# EAGLE design Keybon12 REV 1.0 (EAGLE 9.6.2)
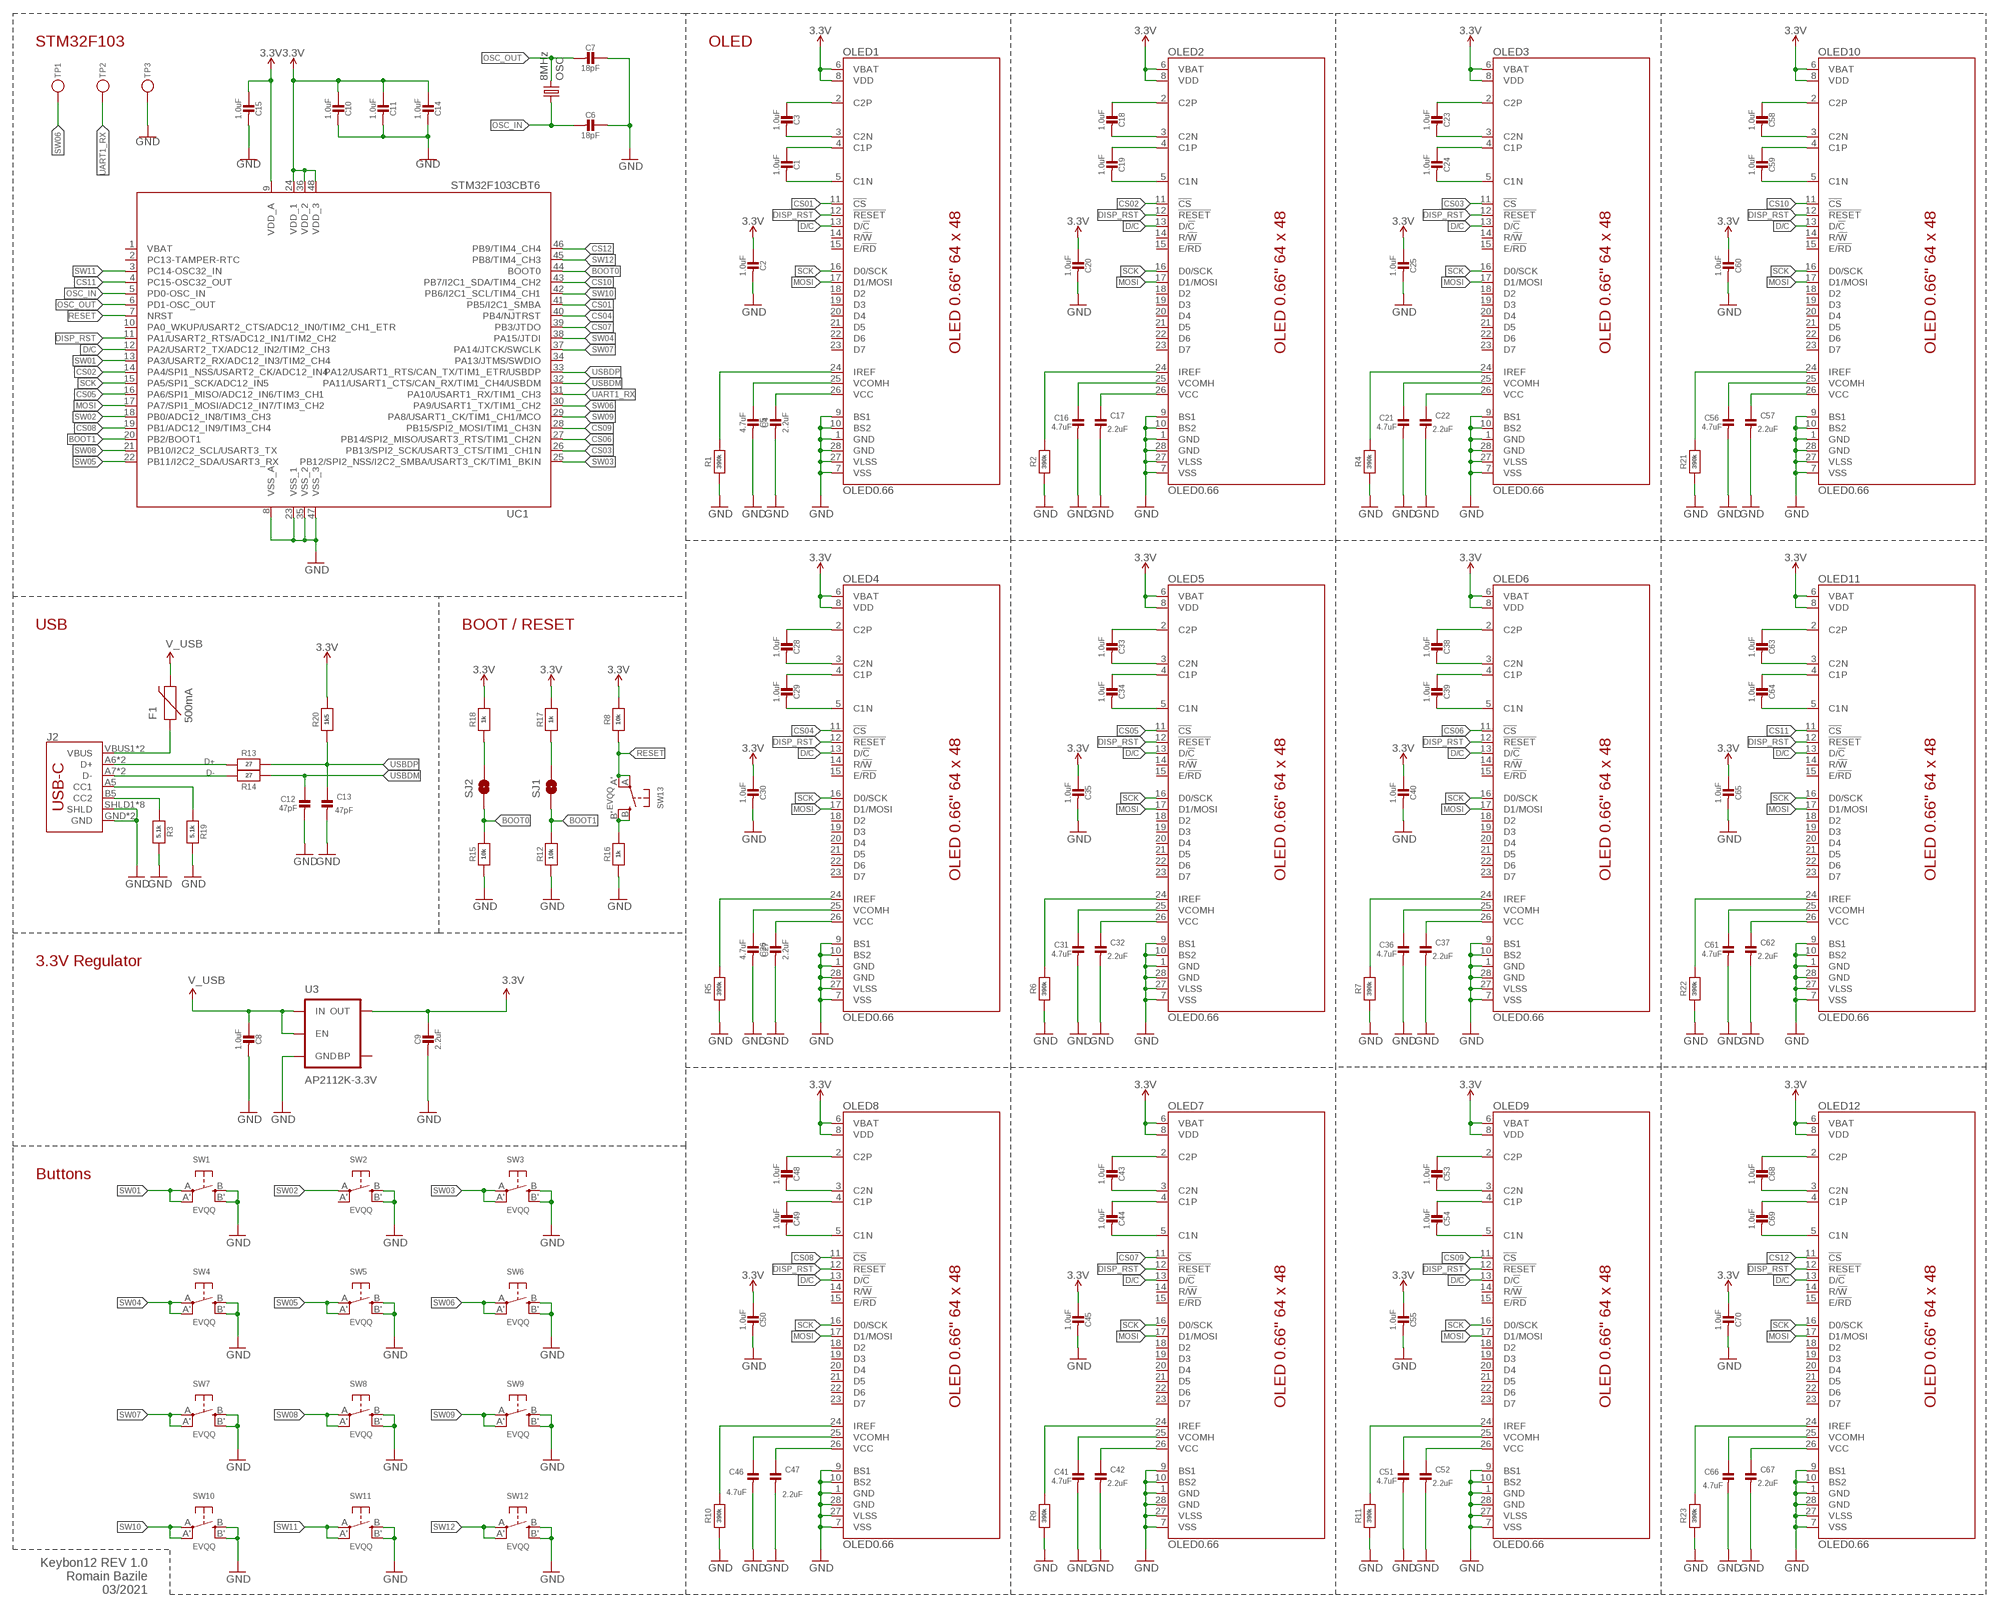
[diagram p0: schematic, sheet 1]

## Parts
C1  1.0uF  CAP_CERAMIC_0805MP  [_0805MP]
C2  1.0uF  CAP_CERAMIC_0805MP  [_0805MP]
C3  1.0uF  CAP_CERAMIC_0805MP  [_0805MP]
C4  2.2uF  CAP_CERAMIC_0805MP  [_0805MP]
C5  4.7uF  CAP_CERAMIC_0805MP  [_0805MP]
C6  18pF  CAP_CERAMIC_0805MP  [_0805MP]
C7  18pF  CAP_CERAMIC_0805MP  [_0805MP]
C8  1.0uF  CAP_CERAMIC_0805MP  [_0805MP]
C9  2.2uF  CAP_CERAMIC_0805MP  [_0805MP]
C10  1.0uF  CAP_CERAMIC_0805MP  [_0805MP]
C11  1.0uF  CAP_CERAMIC_0805MP  [_0805MP]
C12  47pF  CAP_CERAMIC_0805MP  [_0805MP]
C13  47pF  CAP_CERAMIC_0805MP  [_0805MP]
C14  1.0uF  CAP_CERAMIC_0805MP  [_0805MP]
C15  1.0uF  CAP_CERAMIC_0805MP  [_0805MP]
C16  4.7uF  CAP_CERAMIC_0805MP  [_0805MP]
C17  2.2uF  CAP_CERAMIC_0805MP  [_0805MP]
C18  1.0uF  CAP_CERAMIC_0805MP  [_0805MP]
C19  1.0uF  CAP_CERAMIC_0805MP  [_0805MP]
C20  1.0uF  CAP_CERAMIC_0805MP  [_0805MP]
C21  4.7uF  CAP_CERAMIC_0805MP  [_0805MP]
C22  2.2uF  CAP_CERAMIC_0805MP  [_0805MP]
C23  1.0uF  CAP_CERAMIC_0805MP  [_0805MP]
C24  1.0uF  CAP_CERAMIC_0805MP  [_0805MP]
C25  1.0uF  CAP_CERAMIC_0805MP  [_0805MP]
C26  4.7uF  CAP_CERAMIC_0805MP  [_0805MP]
C27  2.2uF  CAP_CERAMIC_0805MP  [_0805MP]
C28  1.0uF  CAP_CERAMIC_0805MP  [_0805MP]
C29  1.0uF  CAP_CERAMIC_0805MP  [_0805MP]
C30  1.0uF  CAP_CERAMIC_0805MP  [_0805MP]
C31  4.7uF  CAP_CERAMIC_0805MP  [_0805MP]
C32  2.2uF  CAP_CERAMIC_0805MP  [_0805MP]
C33  1.0uF  CAP_CERAMIC_0805MP  [_0805MP]
C34  1.0uF  CAP_CERAMIC_0805MP  [_0805MP]
C35  1.0uF  CAP_CERAMIC_0805MP  [_0805MP]
C36  4.7uF  CAP_CERAMIC_0805MP  [_0805MP]
C37  2.2uF  CAP_CERAMIC_0805MP  [_0805MP]
C38  1.0uF  CAP_CERAMIC_0805MP  [_0805MP]
C39  1.0uF  CAP_CERAMIC_0805MP  [_0805MP]
C40  1.0uF  CAP_CERAMIC_0805MP  [_0805MP]
C41  4.7uF  CAP_CERAMIC_0805MP  [_0805MP]
C42  2.2uF  CAP_CERAMIC_0805MP  [_0805MP]
C43  1.0uF  CAP_CERAMIC_0805MP  [_0805MP]
C44  1.0uF  CAP_CERAMIC_0805MP  [_0805MP]
C45  1.0uF  CAP_CERAMIC_0805MP  [_0805MP]
C46  4.7uF  CAP_CERAMIC_0805MP  [_0805MP]
C47  2.2uF  CAP_CERAMIC_0805MP  [_0805MP]
C48  1.0uF  CAP_CERAMIC_0805MP  [_0805MP]
C49  1.0uF  CAP_CERAMIC_0805MP  [_0805MP]
C50  1.0uF  CAP_CERAMIC_0805MP  [_0805MP]
C51  4.7uF  CAP_CERAMIC_0805MP  [_0805MP]
C52  2.2uF  CAP_CERAMIC_0805MP  [_0805MP]
C53  1.0uF  CAP_CERAMIC_0805MP  [_0805MP]
C54  1.0uF  CAP_CERAMIC_0805MP  [_0805MP]
C55  1.0uF  CAP_CERAMIC_0805MP  [_0805MP]
C56  4.7uF  CAP_CERAMIC_0805MP  [_0805MP]
C57  2.2uF  CAP_CERAMIC_0805MP  [_0805MP]
C58  1.0uF  CAP_CERAMIC_0805MP  [_0805MP]
C59  1.0uF  CAP_CERAMIC_0805MP  [_0805MP]
C60  1.0uF  CAP_CERAMIC_0805MP  [_0805MP]
C61  4.7uF  CAP_CERAMIC_0805MP  [_0805MP]
C62  2.2uF  CAP_CERAMIC_0805MP  [_0805MP]
C63  1.0uF  CAP_CERAMIC_0805MP  [_0805MP]
C64  1.0uF  CAP_CERAMIC_0805MP  [_0805MP]
C65  1.0uF  CAP_CERAMIC_0805MP  [_0805MP]
C66  4.7uF  CAP_CERAMIC_0805MP  [_0805MP]
C67  2.2uF  CAP_CERAMIC_0805MP  [_0805MP]
C68  1.0uF  CAP_CERAMIC_0805MP  [_0805MP]
C69  1.0uF  CAP_CERAMIC_0805MP  [_0805MP]
C70  1.0uF  CAP_CERAMIC_0805MP  [_0805MP]
F1  500mA  PTCSMD  [PTC-1206]
J2  USB_C16PIN  [USB-C-16P]
OLED1  OLED0.66  [OLED-0.66-64X48]
OLED2  OLED0.66  [OLED-0.66-64X48]
OLED3  OLED0.66  [OLED-0.66-64X48]
OLED4  OLED0.66  [OLED-0.66-64X48]
OLED5  OLED0.66  [OLED-0.66-64X48]
OLED6  OLED0.66  [OLED-0.66-64X48]
OLED7  OLED0.66  [OLED-0.66-64X48]
OLED8  OLED0.66  [OLED-0.66-64X48]
OLED9  OLED0.66  [OLED-0.66-64X48]
OLED10  OLED0.66  [OLED-0.66-64X48]
OLED11  OLED0.66  [OLED-0.66-64X48]
OLED12  OLED0.66  [OLED-0.66-64X48]
OSC  8MHz  CRYSTAL5X3  [CRYSTAL-SMD-5X3]
R1  390k  RESISTOR_0805MP  [_0805MP]
R2  390k  RESISTOR_0805MP  [_0805MP]
R3  5.1k  RESISTOR_0805MP  [_0805MP]
R4  390k  RESISTOR_0805MP  [_0805MP]
R5  390k  RESISTOR_0805MP  [_0805MP]
R6  390k  RESISTOR_0805MP  [_0805MP]
R7  390k  RESISTOR_0805MP  [_0805MP]
R8  10k  RESISTOR_0805MP  [_0805MP]
R9  390k  RESISTOR_0805MP  [_0805MP]
R10  390k  RESISTOR_0805MP  [_0805MP]
R11  390k  RESISTOR_0805MP  [_0805MP]
R12  10k  RESISTOR_0805MP  [_0805MP]
R13  27  RESISTOR_0805MP  [_0805MP]
R14  27  RESISTOR_0805MP  [_0805MP]
R15  10k  RESISTOR_0805MP  [_0805MP]
R16  1k  RESISTOR_0805MP  [_0805MP]
R17  1k  RESISTOR_0805MP  [_0805MP]
R18  1k  RESISTOR_0805MP  [_0805MP]
R19  5.1k  RESISTOR_0805MP  [_0805MP]
R20  1k5  RESISTOR_0805MP  [_0805MP]
R21  390k  RESISTOR_0805MP  [_0805MP]
R22  390k  RESISTOR_0805MP  [_0805MP]
R23  390k  RESISTOR_0805MP  [_0805MP]
SJ1  JUMPER-PAD-2-NOYES_SILK  [PAD-JUMPER-2-NO_YES_SILK]
SJ2  JUMPER-PAD-2-NOYES_SILK  [PAD-JUMPER-2-NO_YES_SILK]
SW1  EVQQ  SWITCH_TACT_SMT_EVQQ2_SMALL  [EVQ-Q2_SMALLER]
SW2  EVQQ  SWITCH_TACT_SMT_EVQQ2_SMALL  [EVQ-Q2_SMALLER]
SW3  EVQQ  SWITCH_TACT_SMT_EVQQ2_SMALL  [EVQ-Q2_SMALLER]
SW4  EVQQ  SWITCH_TACT_SMT_EVQQ2_SMALL  [EVQ-Q2_SMALLER]
SW5  EVQQ  SWITCH_TACT_SMT_EVQQ2_SMALL  [EVQ-Q2_SMALLER]
SW6  EVQQ  SWITCH_TACT_SMT_EVQQ2_SMALL  [EVQ-Q2_SMALLER]
SW7  EVQQ  SWITCH_TACT_SMT_EVQQ2_SMALL  [EVQ-Q2_SMALLER]
SW8  EVQQ  SWITCH_TACT_SMT_EVQQ2_SMALL  [EVQ-Q2_SMALLER]
SW9  EVQQ  SWITCH_TACT_SMT_EVQQ2_SMALL  [EVQ-Q2_SMALLER]
SW10  EVQQ  SWITCH_TACT_SMT_EVQQ2_SMALL  [EVQ-Q2_SMALLER]
SW11  EVQQ  SWITCH_TACT_SMT_EVQQ2_SMALL  [EVQ-Q2_SMALLER]
SW12  EVQQ  SWITCH_TACT_SMT_EVQQ2_SMALL  [EVQ-Q2_SMALLER]
SW13  EVQQ  SWITCH_TACT_SMT_EVQQ2_SMALL  [EVQ-Q2_SMALLER]
TP1  TESTPOINTPAD2MM  [TESTPOINT_PAD_2MM]
TP2  TESTPOINTPAD2MM  [TESTPOINT_PAD_2MM]
TP3  TESTPOINTPAD2MM  [TESTPOINT_PAD_2MM]
U3  AP2112K-3.3V  V_REG_LDOSMD  [SOT23-5]
UC1  STM32F103CBT6  STM32F103CB  [LQFP48]

## Nets
3.3V: C2.1 C9.1 C10.1 C11.1 C14.1 C15.1 C20.1 C25.1 C30.1 C35.1 C40.1 C45.1 C50.1 C55.1 C60.1 C65.1 C70.1 OLED1.6(VBAT) OLED1.8(VDD) OLED2.6(VBAT) OLED2.8(VDD) OLED3.6(VBAT) OLED3.8(VDD) OLED4.6(VBAT) OLED4.8(VDD) OLED5.6(VBAT) OLED5.8(VDD) OLED6.6(VBAT) OLED6.8(VDD) OLED7.6(VBAT) OLED7.8(VDD) OLED8.6(VBAT) OLED8.8(VDD) OLED9.6(VBAT) OLED9.8(VDD) OLED10.6(VBAT) OLED10.8(VDD) OLED11.6(VBAT) OLED11.8(VDD) OLED12.6(VBAT) OLED12.8(VDD) R8.2 R17.2 R18.2 R20.2 U3.5(OUT) UC1.9(VDD_A) UC1.24(VDD_1) UC1.36(VDD_2) UC1.48(VDD_3)
BOOT0: R15.2 SJ2.1 UC1.44(BOOT0)
BOOT1: R12.2 SJ1.1 UC1.20(PB2/BOOT1)
C1N: C1.2 OLED1.5(C1N)
C1N1: C19.2 OLED2.5(C1N)
C1N2: C24.2 OLED3.5(C1N)
C1N3: C29.2 OLED4.5(C1N)
C1N4: C34.2 OLED5.5(C1N)
C1N5: C39.2 OLED6.5(C1N)
C1N6: C44.2 OLED7.5(C1N)
C1N7: C49.2 OLED8.5(C1N)
C1N8: C54.2 OLED9.5(C1N)
C1N9: C59.2 OLED10.5(C1N)
C1N10: C64.2 OLED11.5(C1N)
C1N11: C69.2 OLED12.5(C1N)
C1P: C1.1 OLED1.4(C1P)
C1P1: C19.1 OLED2.4(C1P)
C1P2: C24.1 OLED3.4(C1P)
C1P3: C29.1 OLED4.4(C1P)
C1P4: C34.1 OLED5.4(C1P)
C1P5: C39.1 OLED6.4(C1P)
C1P6: C44.1 OLED7.4(C1P)
C1P7: C49.1 OLED8.4(C1P)
C1P8: C54.1 OLED9.4(C1P)
C1P9: C59.1 OLED10.4(C1P)
C1P10: C64.1 OLED11.4(C1P)
C1P11: C69.1 OLED12.4(C1P)
C2N: C3.2 OLED1.3(C2N)
C2N1: C18.2 OLED2.3(C2N)
C2N2: C23.2 OLED3.3(C2N)
C2N3: C28.2 OLED4.3(C2N)
C2N4: C33.2 OLED5.3(C2N)
C2N5: C38.2 OLED6.3(C2N)
C2N6: C43.2 OLED7.3(C2N)
C2N7: C48.2 OLED8.3(C2N)
C2N8: C53.2 OLED9.3(C2N)
C2N9: C58.2 OLED10.3(C2N)
C2N10: C63.2 OLED11.3(C2N)
C2N11: C68.2 OLED12.3(C2N)
C2P: C3.1 OLED1.2(C2P)
C2P1: C18.1 OLED2.2(C2P)
C2P2: C23.1 OLED3.2(C2P)
C2P3: C28.1 OLED4.2(C2P)
C2P4: C33.1 OLED5.2(C2P)
C2P5: C38.1 OLED6.2(C2P)
C2P6: C43.1 OLED7.2(C2P)
C2P7: C48.1 OLED8.2(C2P)
C2P8: C53.1 OLED9.2(C2P)
C2P9: C58.1 OLED10.2(C2P)
C2P10: C63.1 OLED11.2(C2P)
C2P11: C68.1 OLED12.2(C2P)
CS01: OLED1.11(!CS!) UC1.41(PB5/I2C1_SMBA)
CS02: OLED2.11(!CS!) UC1.14(PA4/SPI1_NSS/USART2_CK/ADC12_IN4)
CS03: OLED3.11(!CS!) UC1.26(PB13/SPI2_SCK/USART3_CTS/TIM1_CH1N)
CS04: OLED4.11(!CS!) UC1.40(PB4/NJTRST)
CS05: OLED5.11(!CS!) UC1.16(PA6/SPI1_MISO/ADC12_IN6/TIM3_CH1)
CS06: OLED6.11(!CS!) UC1.27(PB14/SPI2_MISO/USART3_RTS/TIM1_CH2N)
CS07: OLED7.11(!CS!) UC1.39(PB3/JTDO)
CS08: OLED8.11(!CS!) UC1.19(PB1/ADC12_IN9/TIM3_CH4)
CS09: OLED9.11(!CS!) UC1.28(PB15/SPI2_MOSI/TIM1_CH3N)
CS10: OLED10.11(!CS!) UC1.43(PB7/I2C1_SDA/TIM4_CH2)
CS11: OLED11.11(!CS!) UC1.4(PC15-OSC32_OUT)
CS12: OLED12.11(!CS!) UC1.46(PB9/TIM4_CH4)
D+: J2.A6(D+) J2.B6(D+) R13.1
D-: J2.A7(D-) J2.B7(D-) R14.1
D/C: OLED1.13(D/!C!) OLED2.13(D/!C!) OLED3.13(D/!C!) OLED4.13(D/!C!) OLED5.13(D/!C!) OLED6.13(D/!C!) OLED7.13(D/!C!) OLED8.13(D/!C!) OLED9.13(D/!C!) OLED10.13(D/!C!) OLED11.13(D/!C!) OLED12.13(D/!C!) UC1.12(PA2/USART2_TX/ADC12_IN2/TIM2_CH3)
DISP_RST: OLED1.12(!RESET!) OLED2.12(!RESET!) OLED3.12(!RESET!) OLED4.12(!RESET!) OLED5.12(!RESET!) OLED6.12(!RESET!) OLED7.12(!RESET!) OLED8.12(!RESET!) OLED9.12(!RESET!) OLED10.12(!RESET!) OLED11.12(!RESET!) OLED12.12(!RESET!) UC1.11(PA1/USART2_RTS/ADC12_IN1/TIM2_CH2)
GND: C2.2 C4.2 C5.2 C6.1 C7.1 C8.2 C9.2 C10.2 C11.2 C12.2 C13.2 C14.2 C15.2 C16.2 C17.2 C20.2 C21.2 C22.2 C25.2 C26.2 C27.2 C30.2 C31.2 C32.2 C35.2 C36.2 C37.2 C40.2 C41.2 C42.2 C45.2 C46.2 C47.2 C50.2 C51.2 C52.2 C55.2 C56.2 C57.2 C60.2 C61.2 C62.2 C65.2 C66.2 C67.2 C70.2 J2.GND J2.GND2(GND) J2.SHLD1(SHLD) J2.SHLD2(SHLD) J2.SHLD3(SHLD) J2.SHLD4(SHLD) J2.SHLD5(SHLD) J2.SHLD6(SHLD) J2.SHLD7(SHLD) J2.SHLD8(SHLD) OLED1.1(GND) OLED1.7(VSS) OLED1.9(BS1) OLED1.10(BS2) OLED1.27(VLSS) OLED1.28(GND) OLED2.1(GND) OLED2.7(VSS) OLED2.9(BS1) OLED2.10(BS2) OLED2.27(VLSS) OLED2.28(GND) OLED3.1(GND) OLED3.7(VSS) OLED3.9(BS1) OLED3.10(BS2) OLED3.27(VLSS) OLED3.28(GND) OLED4.1(GND) OLED4.7(VSS) OLED4.9(BS1) OLED4.10(BS2) OLED4.27(VLSS) OLED4.28(GND) OLED5.1(GND) OLED5.7(VSS) OLED5.9(BS1) OLED5.10(BS2) OLED5.27(VLSS) OLED5.28(GND) OLED6.1(GND) OLED6.7(VSS) OLED6.9(BS1) OLED6.10(BS2) OLED6.27(VLSS) OLED6.28(GND) OLED7.1(GND) OLED7.7(VSS) OLED7.9(BS1) OLED7.10(BS2) OLED7.27(VLSS) OLED7.28(GND) OLED8.1(GND) OLED8.7(VSS) OLED8.9(BS1) OLED8.10(BS2) OLED8.27(VLSS) OLED8.28(GND) OLED9.1(GND) OLED9.7(VSS) OLED9.9(BS1) OLED9.10(BS2) OLED9.27(VLSS) OLED9.28(GND) OLED10.1(GND) OLED10.7(VSS) OLED10.9(BS1) OLED10.10(BS2) OLED10.27(VLSS) OLED10.28(GND) OLED11.1(GND) OLED11.7(VSS) OLED11.9(BS1) OLED11.10(BS2) OLED11.27(VLSS) OLED11.28(GND) OLED12.1(GND) OLED12.7(VSS) OLED12.9(BS1) OLED12.10(BS2) OLED12.27(VLSS) OLED12.28(GND) R1.2 R2.2 R3.2 R4.2 R5.2 R6.2 R7.2 R9.2 R10.2 R11.2 R12.1 R15.1 R16.1 R19.2 R21.2 R22.2 R23.2 SW1.B'(S1) SW1.B(S) SW2.B'(S1) SW2.B(S) SW3.B'(S1) SW3.B(S) SW4.B'(S1) SW4.B(S) SW5.B'(S1) SW5.B(S) SW6.B'(S1) SW6.B(S) SW7.B'(S1) SW7.B(S) SW8.B'(S1) SW8.B(S) SW9.B'(S1) SW9.B(S) SW10.B'(S1) SW10.B(S) SW11.B'(S1) SW11.B(S) SW12.B'(S1) SW12.B(S) TP3.P$1 U3.2(GND) UC1.8(VSS_A) UC1.23(VSS_1) UC1.35(VSS_2) UC1.47(VSS_3)
IREF: OLED1.24(IREF) R1.1
IREF1: OLED2.24(IREF) R2.1
IREF2: OLED3.24(IREF) R4.1
IREF3: OLED4.24(IREF) R5.1
IREF4: OLED5.24(IREF) R6.1
IREF5: OLED6.24(IREF) R7.1
IREF6: OLED7.24(IREF) R9.1
IREF7: OLED8.24(IREF) R10.1
IREF8: OLED9.24(IREF) R11.1
IREF9: OLED10.24(IREF) R21.1
IREF10: OLED11.24(IREF) R22.1
IREF11: OLED12.24(IREF) R23.1
MOSI: OLED1.17(D1/MOSI) OLED2.17(D1/MOSI) OLED3.17(D1/MOSI) OLED4.17(D1/MOSI) OLED5.17(D1/MOSI) OLED6.17(D1/MOSI) OLED7.17(D1/MOSI) OLED8.17(D1/MOSI) OLED9.17(D1/MOSI) OLED10.17(D1/MOSI) OLED11.17(D1/MOSI) OLED12.17(D1/MOSI) UC1.17(PA7/SPI1_MOSI/ADC12_IN7/TIM3_CH2)
N$1: R16.2 SW13.B'(S1) SW13.B(S)
N$2: R18.1 SJ2.2
N$3: R17.1 SJ1.2
N$4: C4.1 OLED1.26(VCC)
N$5: C17.1 OLED2.26(VCC)
N$6: C22.1 OLED3.26(VCC)
N$7: C37.1 OLED6.26(VCC)
N$8: C32.1 OLED5.26(VCC)
N$9: J2.A5(CC1) R19.1
N$10: C27.1 OLED4.26(VCC)
N$11: J2.B5(CC2) R3.1
N$12: C47.1 OLED8.26(VCC)
N$13: C42.1 OLED7.26(VCC)
N$14: C52.1 OLED9.26(VCC)
N$15: C57.1 OLED10.26(VCC)
N$16: C62.1 OLED11.26(VCC)
N$17: C67.1 OLED12.26(VCC)
OSC_IN: C6.2 OSC.1 UC1.5(PD0-OSC_IN)
OSC_OUT: C7.2 OSC.3 UC1.6(PD1-OSC_OUT)
RESET: R8.1 SW13.A'(P1) SW13.A(P) UC1.7(NRST)
SCK: OLED1.16(D0/SCK) OLED2.16(D0/SCK) OLED3.16(D0/SCK) OLED4.16(D0/SCK) OLED5.16(D0/SCK) OLED6.16(D0/SCK) OLED7.16(D0/SCK) OLED8.16(D0/SCK) OLED9.16(D0/SCK) OLED10.16(D0/SCK) OLED11.16(D0/SCK) OLED12.16(D0/SCK) UC1.15(PA5/SPI1_SCK/ADC12_IN5)
SW01: SW1.A'(P1) SW1.A(P) UC1.13(PA3/USART2_RX/ADC12_IN3/TIM2_CH4)
SW02: SW2.A(P) UC1.18(PB0/ADC12_IN8/TIM3_CH3)
SW03: SW3.A'(P1) SW3.A(P) UC1.25(PB12/SPI2_NSS/I2C2_SMBA/USART3_CK/TIM1_BKIN)
SW04: SW4.A'(P1) SW4.A(P) UC1.38(PA15/JTDI)
SW05: SW5.A'(P1) SW5.A(P) UC1.22(PB11/I2C2_SDA/USART3_RX)
SW06: SW6.A'(P1) SW6.A(P) TP1.P$1 UC1.30(PA9/USART1_TX/TIM1_CH2)
SW07: SW7.A'(P1) SW7.A(P) UC1.37(PA14/JTCK/SWCLK)
SW08: SW8.A'(P1) SW8.A(P) UC1.21(PB10/I2C2_SCL/USART3_TX)
SW09: SW9.A'(P1) SW9.A(P) UC1.29(PA8/USART1_CK/TIM1_CH1/MCO)
SW10: SW10.A'(P1) SW10.A(P) UC1.42(PB6/I2C1_SCL/TIM4_CH1)
SW11: SW11.A'(P1) SW11.A(P) UC1.3(PC14-OSC32_IN)
SW12: SW12.A'(P1) SW12.A(P) UC1.45(PB8/TIM4_CH3)
UART1_RX: TP2.P$1 UC1.31(PA10/USART1_RX/TIM1_CH3)
USBDM: C12.1 R14.2 UC1.32(PA11/USART1_CTS/CAN_RX/TIM1_CH4/USBDM)
USBDP: C13.1 R13.2 R20.1 UC1.33(PA12/USART1_RTS/CAN_TX/TIM1_ETR/USBDP)
V_USB: C8.1 F1.2 U3.1(IN) U3.3(EN)
VCOMH: C5.1 OLED1.25(VCOMH)
VCOMH1: C16.1 OLED2.25(VCOMH)
VCOMH2: C21.1 OLED3.25(VCOMH)
VCOMH3: C26.1 OLED4.25(VCOMH)
VCOMH4: C31.1 OLED5.25(VCOMH)
VCOMH5: C36.1 OLED6.25(VCOMH)
VCOMH6: C41.1 OLED7.25(VCOMH)
VCOMH7: C46.1 OLED8.25(VCOMH)
VCOMH8: C51.1 OLED9.25(VCOMH)
VCOMH9: C56.1 OLED10.25(VCOMH)
VCOMH10: C61.1 OLED11.25(VCOMH)
VCOMH11: C66.1 OLED12.25(VCOMH)
VUSB-RAW: F1.1 J2.VBUS1(VBUS) J2.VBUS2(VBUS)
Unconnected: OLED1.14(R/!W!) OLED1.15(E/!RD!) OLED1.18(D2) OLED1.19(D3) OLED1.20(D4) OLED1.21(D5) OLED1.22(D6) OLED1.23(D7) OLED2.14(R/!W!) OLED2.15(E/!RD!) OLED2.18(D2) OLED2.19(D3) OLED2.20(D4) OLED2.21(D5) OLED2.22(D6) OLED2.23(D7) OLED3.14(R/!W!) OLED3.15(E/!RD!) OLED3.18(D2) OLED3.19(D3) OLED3.20(D4) OLED3.21(D5) OLED3.22(D6) OLED3.23(D7) OLED4.14(R/!W!) OLED4.15(E/!RD!) OLED4.18(D2) OLED4.19(D3) OLED4.20(D4) OLED4.21(D5) OLED4.22(D6) OLED4.23(D7) OLED5.14(R/!W!) OLED5.15(E/!RD!) OLED5.18(D2) OLED5.19(D3) OLED5.20(D4) OLED5.21(D5) OLED5.22(D6) OLED5.23(D7) OLED6.14(R/!W!) OLED6.15(E/!RD!) OLED6.18(D2) OLED6.19(D3) OLED6.20(D4) OLED6.21(D5) OLED6.22(D6) OLED6.23(D7) OLED7.14(R/!W!) OLED7.15(E/!RD!) OLED7.18(D2) OLED7.19(D3) OLED7.20(D4) OLED7.21(D5) OLED7.22(D6) OLED7.23(D7) OLED8.14(R/!W!) OLED8.15(E/!RD!) OLED8.18(D2) OLED8.19(D3) OLED8.20(D4) OLED8.21(D5) OLED8.22(D6) OLED8.23(D7) OLED9.14(R/!W!) OLED9.15(E/!RD!) OLED9.18(D2) OLED9.19(D3) OLED9.20(D4) OLED9.21(D5) OLED9.22(D6) OLED9.23(D7) OLED10.14(R/!W!) OLED10.15(E/!RD!) OLED10.18(D2) OLED10.19(D3) OLED10.20(D4) OLED10.21(D5) OLED10.22(D6) OLED10.23(D7) OLED11.14(R/!W!) OLED11.15(E/!RD!) OLED11.18(D2) OLED11.19(D3) OLED11.20(D4) OLED11.21(D5) OLED11.22(D6) OLED11.23(D7) OLED12.14(R/!W!) OLED12.15(E/!RD!) OLED12.18(D2) OLED12.19(D3) OLED12.20(D4) OLED12.21(D5) OLED12.22(D6) OLED12.23(D7) SW2.A'(P1) U3.4(BP) UC1.2(PC13-TAMPER-RTC) UC1.10(PA0_WKUP/USART2_CTS/ADC12_IN0/TIM2_CH1_ETR) UC1.34(PA13/JTMS/SWDIO)

## Notes on the sheet
- STM32F103 | OLED
- USB | BOOT / RESET
- 3.3V Regulator
- Buttons
- Keybon12 REV 1.0
  Romain Bazile
  03/2021

## Power pins joined to a net without a drawn wire
VBAT: UC1.1(VBAT)

## Library data of the parts
C1-C70 = microbuilder:CAP_CERAMIC: Ceramic Capacitors For new designs, use the packages preceded by an '_' character since they are more reliable: The following footprints should be used on most boards: _0402 - Standard footprint for regular board layouts _0603 - Standard footprint for regular board layouts _0805 - Standard footprint for regular board layouts _1206 - Standard footprint for regular board layouts For extremely tight-pitch boards where space is at a premium, the following 'micro-pitch' footprints can be used (smaller pads, no silkscreen outline, etc.): _0402MP - Micro-pitch footprint for very dense/compact boards _0603MP - Micro-pitch footprint for very dense/compact boards _0805MP - Micro-pitch footprint for very dense/compact boards _1206MP - Micro-pitch footprint for very dense/compact boards
F1 = SparkFun-PowerIC:PTC: Resettable Fuse PTC Resettable Fuse. Spark Fun Electronics SKU : COM-08357; PROD_ID: RES-11150
J2 = SparkFun-Connectors:USB_C: USB Type C 16Pin Connector Super Speed pins not available on the 16-pin purely SMD connector so this part is best for USB 2.0 implementations. D1 and D2 are tied together enabling D+/- no matter which way the cable is plugged into the connector. The two channel configuration pins (CC1/2) are exposed. These are normally connected to ground via 5.1k resistors but can be reconfigured for high current/high power applications.; PROD_ID: CONN-14122
OLED1-OLED12 = microView-temp:OLED0.66
OSC = SparkFun2:CRYSTAL: Crystals Various standard crystals. Proven footprints. Spark Fun Electronics SKU : COM-00534
R1-R23 = microbuilder:RESISTOR: Resistors For new designs, use the packages preceded by an '_' character since they are more reliable: The following footprints should be used on most boards: _0402 - Standard footprint for regular board layouts _0603 - Standard footprint for regular board layouts _0805 - Standard footprint for regular board layouts _1206 - Standard footprint for regular board layouts For extremely tight-pitch boards where space is at a premium, the following 'micro-pitch' footprints can be used (smaller pads, no silkscreen outline, etc.): _0402MP - Micro-pitch footprint for very dense/compact boards _0603MP - Micro-pitch footprint for very dense/compact boards _0805MP - Micro-pitch footprint for very dense/compact boards _1206MP - Micro-pitch footprint for very dense/compact boards
SJ1 SJ2 = SparkFun-Passives:JUMPER-PAD-2-NO
SW1-SW13 = microbuilder:SWITCH_TACT_SMT: SMT Tact Switches 6x6mm - Digikey: P12940SCT-ND KMR2 (4.6x2.8mm) - Digikey: 401-1426-1-ND EVQ-PQHB55 - Light Touch, 160GF (4.5x4.5mm) - Digikey: P8090SCT-ND KMT0 - KMT021 NGJ LHS (etc.) IP68/Waterproof - Digikey: CKN10289CT-ND
TP1-TP3 = microbuilder:TESTPOINT: Test Point Various test points for characterisation and PCB testing TESTPOINT_SMT - Compact Surface Mount Test Point [Digikey: 5016KTR-ND]
U3 = SparkFun-PowerIC:V_REG_LDO: Voltage Regulator LDO Standard 150mA LDO voltage regulator in SOT-23 layout. Micrel part MIC5205. BP (by-pass) pin is used to lower output noise with 470pF cap.; PROD_ID: VREG-12457
UC1 = stm32:STM32F103CB

## Board
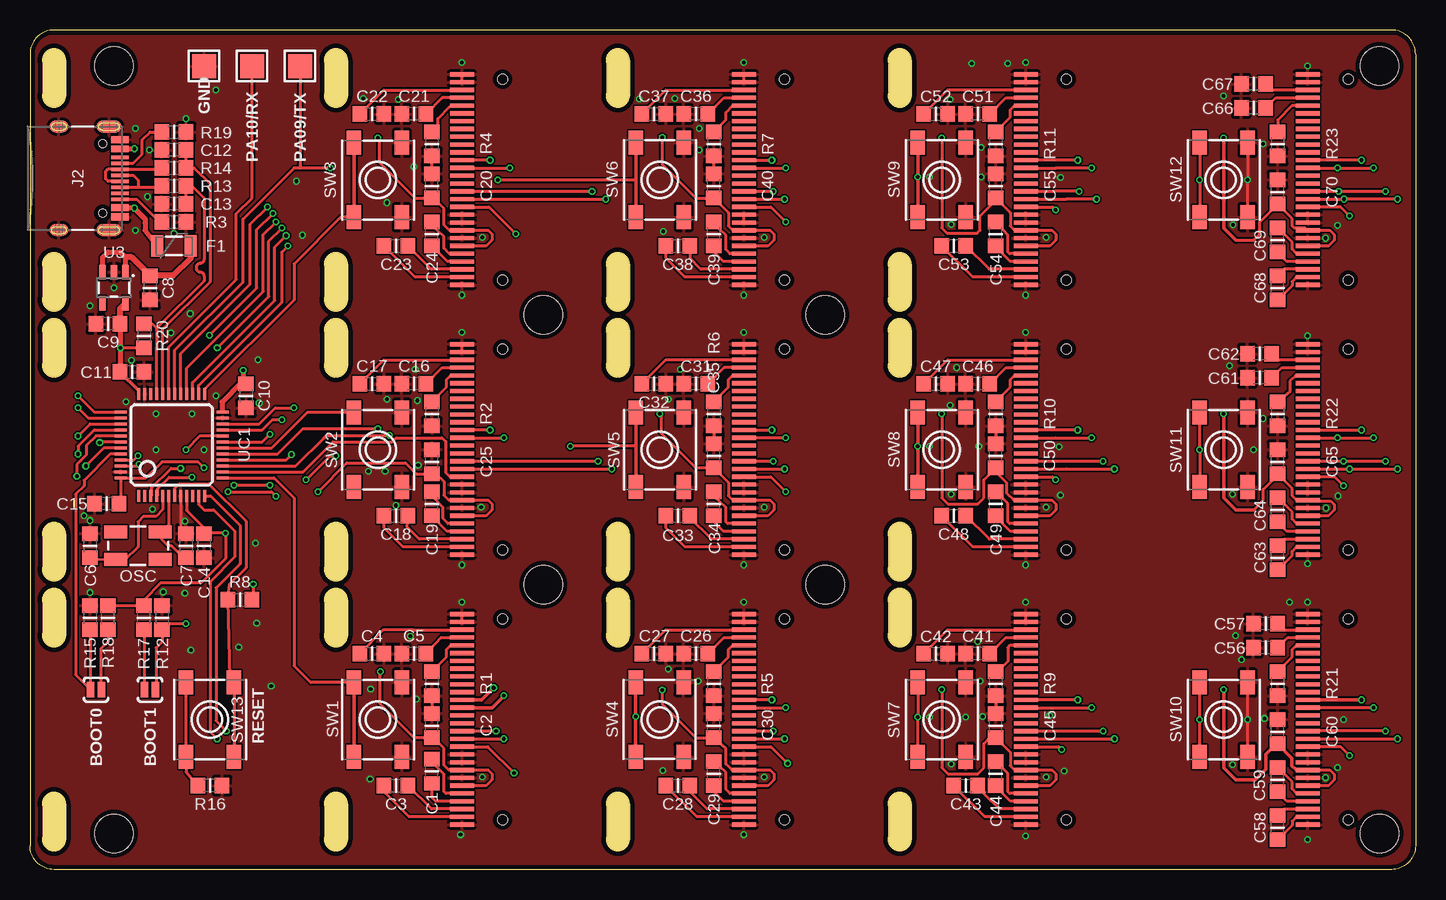
[diagram p1: board, top side]
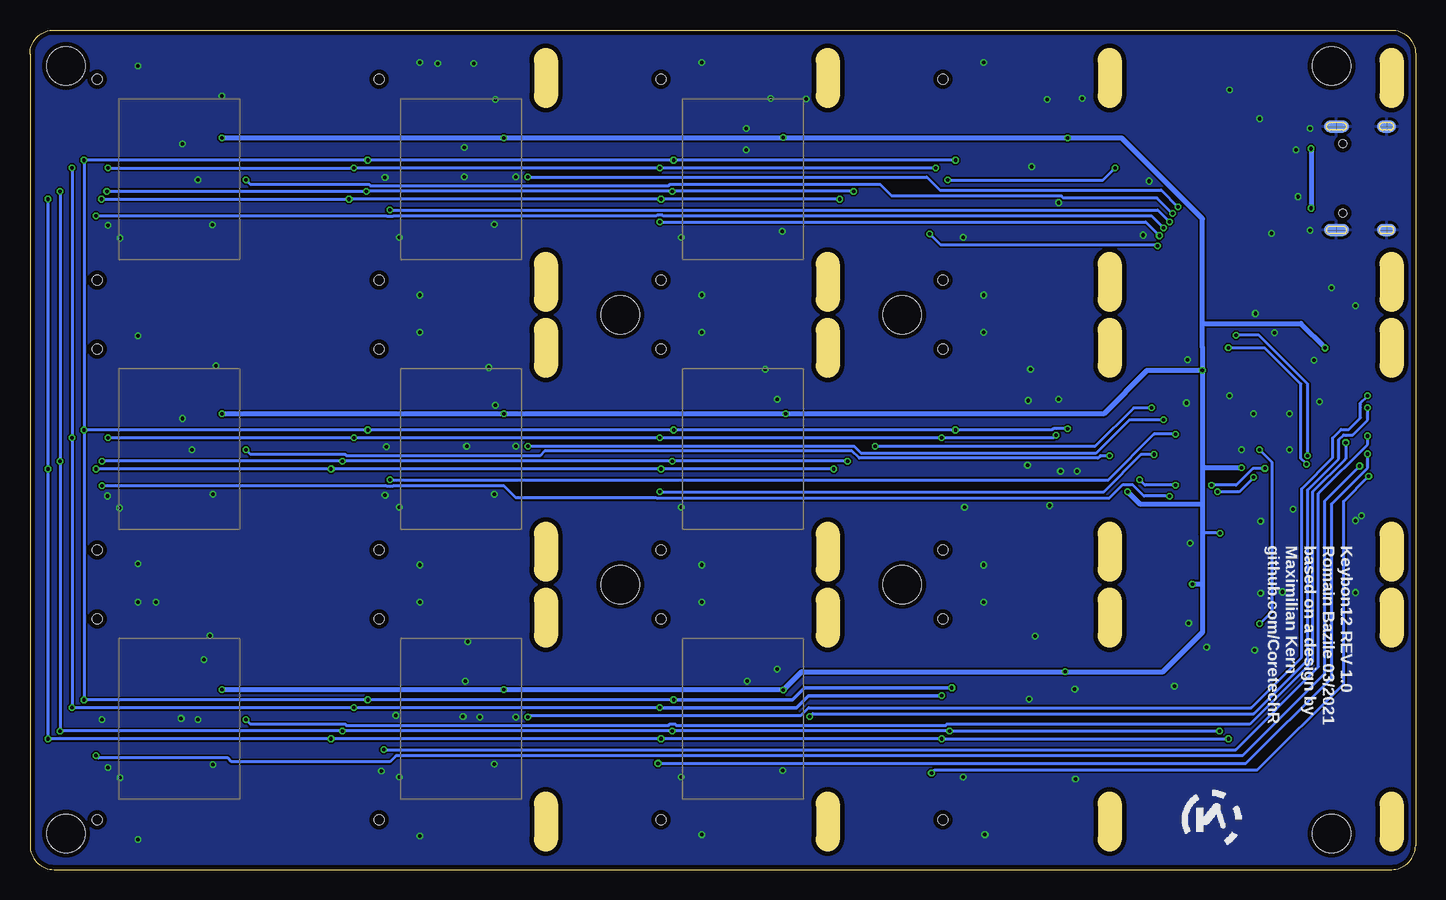
[diagram p2: board, bottom side, seen from below]

Size 115.5 x 70 mm. Coordinates in mm from the lower left corner, seen from the top.
Outline: 49,67.5 49,64.5
Outline: 72.5,67.5 72.5,64.5
Outline: 72.5,50.5 72.5,47.5
Outline: 49,50.5 49,47.5
Outline: 25.5,67.5 25.5,64.5
Outline: 2,67.5 2,64.5
Outline: 25.5,50.5 25.5,47.5
Outline: 2,50.5 2,47.5
Outline: 49,45 49,42
Outline: 72.5,45 72.5,42
Outline: 72.5,28 72.5,25
Outline: 49,28 49,25
Outline: 25.5,45 25.5,42
Outline: 2,45 2,42
Outline: 25.5,28 25.5,25
Outline: 2,28 2,25
Outline: 49,22.5 49,19.5
Outline: 72.5,22.5 72.5,19.5
Outline: 72.5,5.5 72.5,2.5
Outline: 49,5.5 49,2.5
Outline: 25.5,22.5 25.5,19.5
Outline: 2,22.5 2,19.5
Outline: 25.5,5.5 25.5,2.5
Outline: 2,5.5 2,2.5
Outline: 113.5,0 2,0 arc-90 0,2 0,68 arc-90 2,70 113.5,70 arc-90 115.5,68 115.5,2 arc-90 113.5,0
Copper layers (1*16): Top 0.035559375mm / dielectric 1.6mm / Bottom 0.035559375mm
Design rules "oshpark-2layer-tented": minimum track width 6mil, minimum drill 10mil, track to track 6mil, track to pad 6mil, pad to pad 6mil, via to via 6mil, smd to smd 6mil, copper to edge 15mil, drill to drill 6mil, minimum pad ring 5mil, minimum via ring 5mil, stop-mask expansion 2.5mil, vias tented up to drill 20mil, thermal gap 10mil
Holes 3.2 mm at 7,3 112.5,3 112.5,67 7,67 66.3,23.75 42.8,23.75 42.8,46.25 66.3,46.25
Milling: 24 lines

### Footprints (pad centres in the part's own frame; a part is rotated, then mirrored left to right if it is on the bottom)
_0805MP = smd 1.2 x 1.3: 1 -1.016,0; 2 1.016,0
PTC-1206 = smd 1 x 1.8: 1 -1.4,0; 2 1.4,0
USB-C-16P = smd 0.3 x 1.45: A5 -1.25,0; A6 -0.25,0; A7 0.25,0; A8 1.25,0; B5 1.75,0; B6 0.75,0; B7 -0.75,0; B8 -1.75,0 | smd 0.6 x 1.45: GND -3.225,0; GND2 3.225,0 | smd 1 x 2.1: SHLD1 -4.32,-0.915; SHLD2 4.32,-0.915 | smd 1 x 2.1 bottom: SHLD3 -4.32,-0.915; SHLD4 4.32,-0.915 | smd 1 x 1.6: SHLD5 -4.32,-5.095; SHLD8 4.32,-5.095 | smd 1 x 1.6 bottom: SHLD6 -4.32,-5.095; SHLD7 4.32,-5.095 | smd 0.55 x 1.45: VBUS1 -2.45,0; VBUS2 2.45,0 | hole 0.65: -2.89,-1.445; 2.89,-1.445
OLED-0.66-64X48 = smd 0.35 x 2: 1 0,0; 2 0.65,0; 3 1.3,0; 4 1.95,0; 5 2.6,0; 6 3.25,0; 7 3.9,0; 8 4.55,0; 9 5.2,0; 10 5.85,0; 11 6.5,0; 12 7.15,0; 13 7.8,0; 14 8.45,0; 15 9.1,0; 16 9.75,0; 17 10.4,0; 18 11.05,0; 19 11.7,0; 20 12.35,0; 21 13,0; 22 13.65,0; 23 14.3,0; 24 14.95,0; 25 15.6,0; 26 16.25,0; 27 16.9,0; 28 17.55,0 | hole 0.8: 17.15,-3.4; 0.4,-3.4
CRYSTAL-SMD-5X3 = smd 1.9 x 1.1: 1 -1.85,-1.15; 2 1.85,-1.15; 3 1.85,1.15; 4 -1.85,1.15
PAD-JUMPER-2-NO_YES_SILK = smd 0.635 x 1.27: 1 -0.45,0; 2 0.45,0
EVQ-Q2_SMALLER = smd 2 x 1.2: A -3.1,-2; A' 3.1,-2; B -3.1,2; B' 3.1,2
TESTPOINT_PAD_2MM = smd 2 x 2: P$1 0,0
SOT23-5 = smd 0.55 x 1.2: 1 -0.95,-1.3; 2 0,-1.3; 3 0.95,-1.3; 4 0.95,1.3; 5 -0.95,1.3
LQFP48 = smd 0.254 x 1: 1 -2.75,-4.25; 2 -2.25,-4.25; 3 -1.75,-4.25; 4 -1.25,-4.25; 5 -0.75,-4.25; 6 -0.25,-4.25; 7 0.25,-4.25; 8 0.75,-4.25; 9 1.25,-4.25; 10 1.75,-4.25; 11 2.25,-4.25; 12 2.75,-4.25; 25 2.75,4.25; 26 2.25,4.25; 27 1.75,4.25; 28 1.25,4.25; 29 0.75,4.25; 30 0.25,4.25; 31 -0.25,4.25; 32 -0.75,4.25; 33 -1.25,4.25; 34 -1.75,4.25; 35 -2.25,4.25; 36 -2.75,4.25 | smd 1 x 0.254: 13 4.25,-2.75; 14 4.25,-2.25; 15 4.25,-1.75; 16 4.25,-1.25; 17 4.25,-0.75; 18 4.25,-0.25; 19 4.25,0.25; 20 4.25,0.75; 21 4.25,1.25; 22 4.25,1.75; 23 4.25,2.25; 24 4.25,2.75; 37 -4.25,2.75; 38 -4.25,2.25; 39 -4.25,1.75; 40 -4.25,1.25; 41 -4.25,0.75; 42 -4.25,0.25; 43 -4.25,-0.25; 44 -4.25,-0.75; 45 -4.25,-1.25; 46 -4.25,-1.75; 47 -4.25,-2.25; 48 -4.25,-2.75

### Placement (x,y rotation side)
C1  33.5,8.2 90 top
C2  33.5,12 90 top
C3  30.5,7 0 top
C4  28.5,18 0 top
C5  32,18 180 top
C6  5,27 270 top
C7  13,27 270 top
C8  10,48.5 270 top
C9  6.5,45.5 180 top
C10  18,39.5 270 top
C11  8.5,41.5 0 top
C12  12,60 180 top
C13  12,55.5 180 top
C14  14.5,27 270 top
C15  6.4,30.5 180 top
C16  32,40.5 180 top
C17  28.5,40.5 0 top
C18  30.5,29.5 0 top
C19  33.5,30.5 90 top
C20  33.5,57 90 top
C21  32,63 180 top
C22  28.5,63 0 top
C23  30.5,52 0 top
C24  33.5,53 90 top
C25  33.5,34 90 top
C26  55.5,18 180 top
C27  52,18 0 top
C28  54,7 0 top
C29  57,8 90 top
C30  57,12 90 top
C31  55.5,40.5 180 top
C32  52,40.5 0 top
C33  54,29.5 0 top
C34  57,30.5 90 top
C35  57,34.5 90 top
C36  55.5,63 180 top
C37  52,63 0 top
C38  54,52 0 top
C39  57,53 90 top
C40  57,57 90 top
C41  79,18 180 top
C42  75.5,18 0 top
C43  78,7 0 top
C44  80.5,8 90 top
C45  80.5,12 90 top
C46  79,40.5 180 top
C47  75.5,40.5 0 top
C48  77,29.5 0 top
C49  80.5,30.5 90 top
C50  80.5,34.5 90 top
C51  79,63 180 top
C52  75.5,63 0 top
C53  77,52 0 top
C54  80.5,53 90 top
C55  80.5,57 90 top
C56  103,18.5 180 top
C57  103,20.5 180 top
C58  104,3.5 90 top
C59  104,7.5 90 top
C60  104,11.5 90 top
C61  102.5,41 180 top
C62  102.5,43 180 top
C63  104,26 90 top
C64  104,30 90 top
C65  104,34 90 top
C66  102,63.5 180 top
C67  102,65.5 180 top
C68  104,48.5 90 top
C69  104,52.5 90 top
C70  104,56.5 90 top
F1  12,52 0 top
J2  7.5,57.63 270 top
OLED1  36,3.75 90 top
OLED2  36,26.25 90 top
OLED3  36,48.75 90 top
OLED4  59.5,3.75 90 top
OLED5  59.5,26.25 90 top
OLED6  59.5,48.75 90 top
OLED7  83,3.75 90 top
OLED8  83,26.25 90 top
OLED9  83,48.75 90 top
OLED10  106.5,3.75 90 top
OLED11  106.5,26.25 90 top
OLED12  106.5,48.75 90 top
OSC  9,27 0 top
R1  33.5,15.5 270 top
R2  33.5,38 270 top
R3  12,54 0 top
R4  33.5,60.5 270 top
R5  57,15.5 270 top
R6  57,38 270 top
R7  57,60.5 270 top
R8  17.5,22.5 0 top
R9  80.5,15.5 270 top
R10  80.5,38 270 top
R11  80.5,60.5 270 top
R12  11,21 270 top
R13  12,57 0 top
R14  12,58.5 0 top
R15  5,21 270 top
R16  15,7 180 top
R17  9.5,21 90 top
R18  6.5,21 90 top
R19  12,61.5 0 top
R20  9.5,44.5 270 top
R21  104,15.5 270 top
R22  104,38 270 top
R23  104,60.5 270 top
SJ1  10,15 180 top
SJ2  5.5,15 0 top
SW1  29,12.5 270 top
SW2  29,35 270 top
SW3  29,57.49 270 top
SW4  52.49,12.51 270 top
SW5  52.5,35 270 top
SW6  52.5,57.5 270 top
SW7  76.01,12.5 270 top
SW8  76,35 270 top
SW9  76,57.5 270 top
SW10  99.5,12.5 270 top
SW11  99.5,35 270 top
SW12  99.5,57.5 270 top
SW13  15,12.5 90 top
TP1  22.5,67 0 top
TP2  18.5,67 0 top
TP3  14.5,67 0 top
U3  7,48.5 180 top
UC1  11.81,35.41 0 top

### Tracks (layer width: path | path; a pad name or v marks a point on that pad's centre or on a via)
3.3V  (via drill 0.3)
  Top 0.25: OLED11.6 108.24,29.5 108.72,29.98 108.72,30.42 108.42,30.73 106.58,30.73 OLED11.8 105.58,30.8 105.22,31.16 105.22,31.76 C65.1 104,32.9 102.8,31.7 102.8,30.8 102,30 | OLED10.8 108.34,8.3 108.72,7.92 108.72,7.48 108.24,7 OLED10.6 | OLED12.6 108.24,52 108.72,52.48 108.72,52.92 108.34,53.3 OLED12.8 106.3,53.5 105.39,53.5 105.22,53.66 105.22,54.26 C70.1 102.5,53.98 102.5,53 102,52.5 100.5,52.5 | v18.6,23.8 18.6,22.75 R8.2 | UC1.48 7.56,30.64 C15.1 | 31.29,33.9 32.21,32.98 C25.1 33.87,32.98 34.5,32.35 | R20.2 v7.53,43.48 7.52,43.5 | C55.1 81.72,54.76 81.72,53.66 82.08,53.3 OLED9.8 | 52.7,58.8 55.52,55.98 C40.1 58.22,54.76 58.22,53.66 58.58,53.3 60,53.3 | 52.6,36.4 55.52,33.48 C35.1 58.22,32.26 58.22,31.16 58.58,30.8 60,30.8 | 52.7,13.8 55.52,10.98 C30.1 | 34.5,10.1 33.62,10.98 C2.1 32.02,10.98 29.2,13.8 | 29.1,59 32.12,55.98 C20.1 33.62,55.98 34.5,55.1 | 76,8.5 76.5,8 79,8 79.5,8.5 79.5,10.5 79.98,10.98 C45.1 80.52,10.98 81.72,9.78 81.72,8.66 82.08,8.3 83.5,8.3 | 76,31 76.5,30.5 79,30.5 79.5,31 79.5,32.5 80.48,33.48 C50.1 | 82,30.8 81.43,31.37 81.43,32.23 80.5,33.15 C50.1 | 103.88,10.48 C60.1
  Top 0.254: C30.1 58,10.1 58,8.8 58.5,8.3 OLED4.8 61.7,8.3 62,8 62,7.5 61.5,7 OLED4.6 | 34.5,10.1 34.5,8.7 34.9,8.3 OLED1.8 38.2,8.3 38.5,8 38.5,7.5 38,7 OLED1.6 | v52.7,14.97 52.7,13.8 | 29.2,13.8 v29.2,16.5 | 34.5,55.1 34.5,53.75 34.95,53.3 OLED3.8 38.2,53.3 38.5,53 38.5,52.5 38,52 OLED3.6 | 29.1,59 29.1,61 v29,61 | 52.6,36.4 52.6,36.5 52.6,38 v52.5,38 | v52.7,61.06 52.7,58.8 | 82,30.8 OLED8.8 85.2,30.8 85.5,30.5 85.5,30 85,29.5 OLED8.6 | C50.1 | UC1.9 13.06,29.94 14.52,28.48 C14.1 14.51,28.05 v16.3,28.05 16.3,25.93 14.27,23.9 10.9,23.9 9.5,22.5 R17.2 R18.2 | 16,38.22 UC1.24 | 34.5,32.35 34.5,31.2 34.9,30.8 OLED2.8 38.2,30.8 38.5,30.5 38.5,30 38,29.5 OLED2.6 | 17.61,40.61 C10.1 17.77,40.77 | C55.1 80.5,55.8 79.2,54.5 79.2,53.3 78.95,53.05 76.45,53.05 76,53.5 v76,61 | v76,38 76,31 | v76,15 76,8.5 | 31.29,33.9 26.4,33.9 v24,31.5 | UC1.48 9.65,32.66 11,34 14,34 v14.5,33.5 | OLED6.8 60,53.3 61.7,53.3 62,53 62,52.5 61.5,52 OLED6.6 | OLED9.8 85.2,53.3 85.5,53 85.5,52.5 85,52 OLED9.6 | OLED7.8 83.5,8.3 85.2,8.3 85.5,8 85.5,7.5 85,7 OLED7.6 | OLED5.8 60,30.8 61.7,30.8 62,30.5 62,30 61.5,29.5 OLED5.6
  Top 0.3: v99.5,61 99.5,53.5 100.5,52.5 | v99.5,15 99.5,8.5 100.5,7.5 102.13,7.5 103,8.37 103,9.61 103.88,10.48 | v99.5,38 99.5,31 100.5,30 102,30 | C11.1 9.06,39.92 UC1.36 | C60.1 105.2,9.29 105.2,8.65 105.55,8.3 OLED10.8
  Top 0.4: C9.1 7.52,43.5 7.52,41.53 C11.1
  Top 0.406: 16,38.22 16,39 17.61,40.61 | v17.77,41.62 17.77,40.77
  Top 0.5: 7.52,41.53 C11.1 | C9.1 7.52,46.77 U3.5
  Bottom 0.254: v52.7,61.06 52.56,61.06 52.5,61 | v16.3,28.05 17.72,28.05 17.77,28
  Bottom 0.4: v76,61 v99.5,61 | v76,38 v99.5,38 | v76,15 v99.5,15 | 51.17,16.5 v29.2,16.5 21.05,16.5 17.75,19.8 17.75,23.8 | 17.75,23.8 17.75,27.98 17.77,28 | v18.6,23.8 17.75,23.8 | 9.55,45.53 7.53,43.51 v7.53,43.48
  Bottom 0.406: 17.77,45.53 9.55,45.53 | v17.77,41.62 17.77,43.53 17.77,45.53 | v17.77,41.62 17.77,33.5 | 17.77,33.5 17.77,32 17.77,30.5 | 17.77,30.5 17.77,28 | v76,15 52.73,15 v52.7,14.97 51.17,16.5 | 17.77,45.53 17.77,54.27 24.5,61 v29,61 52.5,61 v76,61 | v76,38 v52.5,38 26,38 22.38,41.62 v17.77,41.62 | v24,31.5 23,30.5 17.77,30.5 | v14.5,33.5 17.77,33.5
BOOT0
  Top 0.25: 6.7,34.66 4.5,32.45 4.5,32 3.8,31.3 3.8,16.25
  Top 0.254: UC1.44 6.7,34.66 | 3.8,16.25 SJ2.1 5,15.05 R15.2
BOOT1  (via drill 0.3)
  Top 0.254: UC1.20 14.15,36.16 v13,35 | SJ1.1 10.5,15.05 10.5,18.5 11,19 R12.2 11.35,20.5 v13,20.5
  Bottom 0.254: v13,35 12,34 12,21.5 v13,20.5
C1N
  Top 0.25: 34.5,7.94 33.5,8.94 C1.2
  Top 0.254: OLED1.5 34.65,6.35 34.5,6.5 34.5,7.94
C1N1
  Top 0.25: 34.5,29.2 34.43,29.27 34.43,30.2 33.5,31.13 C19.2
  Top 0.254: OLED2.5 34.85,28.85 34.5,29.2
C1N2
  Top 0.254: OLED3.5 34.95,51.35 34.5,51.8 34.5,52.75 33.5,53.67 C24.2
C1N3
  Top 0.254: OLED4.5 58.35,6.35 58,6.7 58,8.1 C29.2
C1N4
  Top 0.254: OLED5.5 58.15,28.85 58,29 58,30.2 57,31.12 C34.2
C1N5
  Top 0.254: OLED6.5 58.35,51.35 58,51.7 58,52.9 57,53.81 C39.2
C1N6
  Top 0.25: OLED7.5 81.65,6.35 81.5,6.5 81.5,8.02 C44.2
C1N7
  Top 0.25: OLED8.5 81.65,28.85 81.5,29 81.5,30.52 C49.2
C1N8
  Top 0.254: OLED9.5 81.65,51.35 81.5,51.5 81.5,52.9 C54.2
C1N9
  Top 0.25: C59.2 105.22,7.29 105.22,6.71 105.58,6.35 OLED10.5
C1N10
  Top 0.25: C64.2 105.22,29.79 105.22,29.21 105.58,28.85 OLED11.5
C1N11
  Top 0.25: C69.2 105.22,52.29 105.22,51.71 105.58,51.35 OLED12.5
C1P
  Top 0.254: OLED1.4 33.8,5.7 33.5,6 C1.1
C1P1
  Top 0.25: OLED2.4 34.78,28.2 C19.1
C1P2
  Top 0.254: OLED3.4 34.8,50.7 33.52,51.98 C24.1
C1P3
  Top 0.254: OLED4.4 57.8,5.7 56.52,6.98 C29.1
C1P4
  Top 0.254: OLED5.4 57.8,28.2 57,29 C34.1
C1P5
  Top 0.254: OLED6.4 57.8,50.7 57,51.5 C39.1
C1P6
  Top 0.25: C44.1 81.1,6.39 81.1,6.33 81.73,5.7 OLED7.4
C1P7
  Top 0.25: C49.1 81.1,28.89 81.1,28.83 81.73,28.2 OLED8.4
C1P8
  Top 0.25: C54.1 81.1,51.39 81.1,51.33 81.73,50.7 OLED9.4
C1P9
  Top 0.25: C59.1 104.78,5.7 OLED10.4
C1P10
  Top 0.25: OLED11.4 104.78,28.2 C64.1
C1P11
  Top 0.25: C69.1 104.78,50.7 OLED12.4
C2N
  Top 0.254: OLED1.3 33.47,5.05 C3.2
C2N1
  Top 0.254: OLED2.3 32.45,27.55 31.4,28.6 C18.2
C2N2
  Top 0.254: OLED3.3 33.45,50.05 31.52,51.98 C23.2
C2N3
  Top 0.25: 56.45,5.05 55.02,6.48 C28.2
  Top 0.254: OLED4.3 56.45,5.05
C2N4
  Top 0.254: OLED5.3 56.8,27.55 55,29.35 C33.2
C2N5
  Top 0.254: OLED6.3 55.91,50.05 55.02,50.98 C38.2
C2N6
  Top 0.25: C43.2 79.57,6.44 79.57,6.27 80.79,5.05 OLED7.3
C2N7
  Top 0.25: OLED8.3 79.97,27.55 C48.2
C2N8
  Top 0.25: C53.2 79.97,50.05 OLED9.3
C2N9
  Top 0.25: C58.2 104.53,5.05 OLED10.3
C2N10
  Top 0.25: C63.2 104.53,27.55 OLED11.3
C2N11
  Top 0.25: OLED12.3 104.53,50.05 C68.2
C2P
  Top 0.254: OLED1.2 31.6,4.4 29.6,6.4 C3.1
C2P1
  Top 0.254: OLED2.2 31.1,26.9 29.48,28.52 C18.1
C2P2
  Top 0.254: OLED3.2 32.1,49.4 29.5,52 C23.1
C2P3
  Top 0.25: 55.6,4.4 55.58,4.4 C28.1
  Top 0.254: OLED4.2 55.6,4.4
C2P4
  Top 0.254: OLED5.2 54.6,26.9 52.98,28.52 C33.1
C2P5
  Top 0.254: OLED6.2 54.6,49.4 52.98,51.02 C38.1
C2P6
  Top 0.25: OLED7.2 79.58,4.4 C43.1
C2P7
  Top 0.25: OLED8.2 78.58,26.9 C48.1
C2P8
  Top 0.25: OLED9.2 78.58,49.4 C53.1
C2P9
  Top 0.25: C58.1 105.22,3.71 105.22,4.04 105.58,4.4 OLED10.2
C2P10
  Top 0.25: C63.1 105.22,26.21 105.22,26.54 105.58,26.9 OLED11.2
C2P11
  Top 0.25: C68.1 105.22,48.71 105.22,49.04 105.58,49.4 OLED12.2
CS01  (via drill 0.3)
  Top 0.25: 5.5,36.16 4.7,35.35 4.7,34.57 3.9,33.77 v3.9,32.8
  Top 0.254: OLED1.11 38.15,10.25 v40.35,8.05 | UC1.41 5.5,36.16
  Bottom 0.254: v40.35,8.05 40.1,8.3 13.2,8.3 6,15.5 6,30.7 v3.9,32.8
CS02
  Top 0.25: 25.25,35.65 30.18,35.65 30.53,36 34.35,36 34.65,35.7
  Top 0.254: OLED2.11 35,32.75 34.65,33.1 34.65,35.7 | 25.25,35.65 22.75,33.16 UC1.14
CS03  (via drill 0.3)
  Top 0.254: OLED3.11 38.25,55.25 v40.5,53 | UC1.26 14.06,40.36 21,47.3 21,51.5 v21.5,52
  Bottom 0.254: v21.5,52 21.6,52.1 39.6,52.1 v40.5,53
CS04  (via drill 0.3)
  Top 0.254: OLED4.11 61.75,10.25 v63.15,8.85 | v4,34.65 4,35.3 5.36,36.66 UC1.40
  Bottom 0.254: v63.15,8.85 50.5,8.85 14.15,8.85 7,16 7,30.5 4,33.5 v4,34.65
CS05  (via drill 0.3)
  Top 0.254: OLED5.11 61.75,32.75 v63,31.5 | UC1.16 21.36,34.16 v21.8,34.6
  Bottom 0.254: v63,31.5 26,31.5 22.9,34.6 v21.8,34.6
CS06  (via drill 0.3)
  Top 0.254: OLED6.11 61.75,55.25 v63,54 | UC1.27 13.56,40.61 20.4,47.45 20.4,51.9 v21.35,52.85
  Bottom 0.254: v63,54 22.5,54 v21.35,52.85
CS07  (via drill 0.3)
  Top 0.254: OLED7.11 85.75,10.25 v86,10 | v4,36.15 5,37.16 UC1.39
  Bottom 0.254: v86,10 15,10 8.1,16.9 8.1,31.35 4,35.45 v4,36.15
CS08  (via drill 0.3)
  Top 0.254: OLED8.11 85.25,32.75 v85.5,32.5 | UC1.19 19.36,35.66 v20,36.3
  Bottom 0.254: v85.5,32.5 25.6,32.5 21.8,36.3 v20,36.3
CS09  (via drill 0.3)
  Top 0.254: OLED9.11 85.25,55.25 v85.5,55 | UC1.28 13.06,41.81 19.45,48.2 19.45,52.95 v20.5,54
  Bottom 0.254: v85.5,55 21.5,55 v20.5,54
CS10  (via drill 0.3)
  Top 0.25: UC1.43 6.16,35.16 v4.65,33.65 | v110,9.5 109.25,10.25 OLED10.11
  Bottom 0.25: v4.65,33.65 7.6,30.7 7.6,16.33 14.43,9.5 59.5,9.5 85,9.5 85.5,9 98.72,9 99.02,9.3 109.8,9.3 v110,9.5
CS11  (via drill 0.3)
  Top 0.25: UC1.4 10.66,31.25 10.66,31.77 11.59,32.71 v13.5,32.71 | v16.5,31.5 20.13,31.5 v20.5,31.13 | v109.5,32 108.75,32.75 OLED11.11
  Bottom 0.25: v13.5,32.71 14.71,31.5 v16.5,31.5 | v20.5,31.13 22.63,31.13 23.55,32.05 24.45,32.05 25.55,30.95 63.23,30.95 63.28,31 75,31 76,32 85.22,32 85.27,31.95 85.73,31.95 85.78,32 v109.5,32
CS12  (via drill 0.3)
  Top 0.25: UC1.46 8.94,33.66 v9.08,33.79 | v15.6,43.5 15.62,43.5 19.9,47.78 19.9,52.4 v21,53.5 | v110,54.5 109.25,55.25 OLED12.11
  Bottom 0.25: v9.08,33.79 9.55,34.27 9.55,40.48 12.57,43.5 v15.6,43.5 | v21,53.5 22,54.5 62.72,54.5 62.77,54.55 63.23,54.55 63.28,54.5 85.22,54.5 85.27,54.45 85.73,54.45 85.78,54.5 v110,54.5
D+
  Top 0.25: J2.A6 8.62,57.88 9,57.5 9,56.88
  Top 0.254: J2.B6 9,56.88 11,56.88 R13.1
D-
  Top 0.254: 11.04,58.38 J2.B7 6.49,58.38 6.3,58.2 6.3,57.6 6.51,57.38 J2.A7
  Top 0.305: 11.04,58.38 R14.1
D/C  (via drill 0.3)
  Top 0.25: OLED12.13 v109.1,56.55 v113,56.55 | v113,11.55 OLED10.13 | OLED11.13 v109.5,34.05 v113,34.05
  Top 0.254: OLED1.13 v38.85,11.55 | OLED7.13 v89.45,11.55 | OLED4.13 v61.95,11.55 | OLED2.13 v47.35,34.05 | OLED8.13 85.45,34.05 v89.45,34.05 | OLED5.13 v61.95,34.05 | OLED3.13 v46.85,56.55 | OLED9.13 85.45,56.55 v87.45,56.55 | OLED6.13 v61.95,56.55 | UC1.12 15.04,31.16 17.5,28.7 17.5,25.5 15.5,23.5 15.5,12.4 v16.35,11.55
  Bottom 0.25: v109.1,56.55 v87.45,56.55 | v113,56.55 v113,34.05 v113,11.55 v89.45,11.55 | v89.45,34.05 v109.5,34.05
  Bottom 0.254: v89.45,11.55 v61.95,11.55 v38.85,11.55 v16.35,11.55 | v47.35,34.05 v61.95,34.05 v89.45,34.05 | v46.85,56.55 v61.95,56.55 v87.45,56.55
DISP_RST  (via drill 0.3)
  Top 0.25: OLED12.12 v109.55,55.9 v114,55.9 | OLED10.12 v114,10.9 | OLED11.12 v110,33.4 v114,33.4
  Top 0.254: OLED1.12 v39.5,10.9 | OLED4.12 v62.9,10.9 | OLED7.12 v90.4,10.9 | OLED2.12 v48.5,33.4 | OLED5.12 v62.9,33.4 | OLED8.12 86.4,33.4 v90.4,33.4 | OLED3.12 v48,55.9 | OLED6.12 v62.9,55.9 | OLED9.12 86.4,55.9 v88.9,55.9 | UC1.11 14.06,30.44 14.5,30 15.3,30 17.05,28.25 17.05,26.05 15,24 15,11.5 v15.6,10.9
  Bottom 0.25: v109.55,55.9 v88.9,55.9 | v114,55.9 v114,33.4 v114,10.9 v90.4,10.9 | v90.4,33.4 v110,33.4
  Bottom 0.254: v90.4,10.9 v62.9,10.9 v39.5,10.9 v15.6,10.9 | v48.5,33.4 v62.9,33.4 v90.4,33.4 | v48,55.9 v62.9,55.9 v88.9,55.9
GND  (via drill 0.3)
  Top 0.25: OLED1.27 OLED1.28 | SW10.B' SW10.B | SW12.B v101.5,57.5 SW12.B'
  Top 0.254: R1.2 C2.2 | C20.2 R4.2 | R6.2 C35.2 | C40.2 R7.2 | R9.2 C45.2 | OLED2.27 OLED2.28 | OLED5.27 OLED5.28 | OLED6.27 OLED6.28 | OLED6.9 OLED6.10 | OLED3.27 OLED3.28 | OLED4.27 OLED4.28 | OLED7.27 OLED7.28 | OLED8.27 OLED8.28 | OLED9.27 OLED9.28 | R10.2 C50.2 | 78,32.5 SW8.B' 78,31 | 78,10 SW7.B' | UC1.47 7.04,33.16 | UC1.8 12.56,28.18
  other vias: 8.45,42.45 15.5,65 37.6,30.2 61.2,30.2 84.7,30.2 84.7,52.7 61.2,52.7 37.7,52.7 37.7,7.7 61.2,7.7 84.7,7.7 12,53.05 79.2,15.7 86.2,8.2 76.7,38.7 85.9,31.2 54.2,41.7 77.25,41.85 53.2,39.2 76.7,64.2 53.75,64.3 30.7,64.2 13,62.6 9.95,60 9.8,56.1 7,48.5 5,47 19.1,38.9 29.75,55.6 32,58.6 55.8,60 55.8,61.8 52.8,53.2 79.3,60.2 79.3,57.75 85.9,57.7 76.8,53.8 78.5,67.2 50.8,64.25 27.8,64.3 8.8,61.8 8.8,53.3 32.1,41.7 32.3,39.1 29.75,39.2 30.5,30.35 32.35,33.7 29.6,33.2 79.1,35.3 85.8,35.25 76.8,31.3 76.8,8.8 79.4,12.75 85,12.85 79,19 83,2.8 59.5,2.9 35.9,2.9 36,22.3 59.5,22.3 83,22.3 83,44.8 59.5,44.8 36,44.8 36,67.3 59.5,67.3 83,67.3 4.5,29.5 5,29.1 5,23.1 36,25.4 59.5,25.4 83,25.4 83,47.9 36,47.9 59.5,47.9 81.5,67.2 10.5,38 10.5,35 13.5,38 53.2,16.7 31.7,19.45 32.2,14.2 55.7,15.7 52.75,8.25 20.1,15.3 28.35,7.55 22.7,52.9 22.2,57.4 75,57.75 75,12.7 75,35.3 28.2,33.2 18.8,27.2 14.5,35 13.4,18.3 11.1,23.15 108,52.65 108.05,30.15 108,7.65 106.5,22.3 105,22.3 101,17.5 102.9,12.6 109.5,12.5 106.5,2.5 100.3,53.75 100.25,31.3 100.25,8.75 101.5,12.5 78,12.7 11.75,44.75 13.35,46.35 19,42.5 15.5,39.5 8,39 10.2,30.05 12.9,29.05 12.9,23.05 17.4,18.55 18.9,20.55 28.4,15.05 109.05,31.15 102.8,37.6 100,42 99.5,64.5 106.5,67 109,53.7 102.8,60.5 106.5,44.5 102,35 106.5,25.5 100.5,19.5 109,8.5
  pour Bottom: 0,70 115.5,70 115.5,0 0,0
  pour Top: 0,70 115.5,70 115.5,0 0,0
IREF
  Top 0.25: R1.1 34.72,17.74 34.72,18.34 35.08,18.7 OLED1.24
IREF1
  Top 0.25: R2.1 34.72,40.24 34.72,40.84 35.08,41.2 OLED2.24
IREF2
  Top 0.25: R4.1 34,62.02 34,62.62 35.08,63.7 OLED3.24
IREF3
  Top 0.25: R5.1 58.22,17.74 58.22,18.34 58.58,18.7 OLED4.24
IREF4
  Top 0.25: R6.1 58.22,40.24 58.22,40.84 58.58,41.2 OLED5.24
IREF5
  Top 0.25: R7.1 58,62.52 58,63.12 58.58,63.7 OLED6.24
IREF6
  Top 0.254: R9.1 80.67,16.52 81.5,17.35 81.5,18.5 81.7,18.7 OLED7.24
IREF7
  Top 0.25: R10.1 81.72,40.24 81.72,40.84 82.08,41.2 OLED8.24
IREF8
  Top 0.25: R11.1 81.72,62.74 81.72,63.34 82.08,63.7 OLED9.24
IREF9
  Top 0.25: R21.1 105.22,17.74 105.22,18.34 105.58,18.7 OLED10.24
IREF10
  Top 0.25: R22.1 105.03,39.88 105.03,40.72 105.51,41.2 OLED11.24
IREF11
  Top 0.25: OLED12.24 105.2,63.7 104,62.5 R23.1
MOSI  (via drill 0.3)
  Top 0.25: v111,59.15 OLED12.17 | OLED11.17 v111,36.65 | 22.55,36.55 22.76,36.76 v29,36.76
  Top 0.254: OLED5.17 v61.85,36.65 | v87.35,36.65 OLED8.17 | v87.35,59.15 OLED9.17 | v87.35,14.15 OLED7.17 | v61.85,14.15 OLED4.17 | v38.35,36.65 OLED2.17 | v38.35,59.15 OLED3.17 | 22.55,36.55 20.66,34.66 UC1.17 | OLED6.17 v61.85,59.15
  Top 0.3: v111,14.15 OLED10.17
  Top 0.305: OLED1.17 37.65,14.15 v38.65,15.15
  Bottom 0.25: v87.35,59.15 v111,59.15 v111,36.65 | v111,36.65 v111,14.15 v87.35,14.15 | v87.35,36.65 v111,36.65 | v38.35,36.65 30.29,36.65 30.18,36.76 v29,36.76
  Bottom 0.254: v61.85,14.15 v87.35,14.15 | v38.35,36.65 v61.85,36.65 v87.35,36.65 | v38.35,59.15 v61.85,59.15 v87.35,59.15
  Bottom 0.305: v38.65,15.15 50.95,15.15 51.95,14.15 v61.85,14.15
N$1
  Top 0.254: SW13.B' SW13.B 13,8.15 R16.2
N$2
  Top 0.254: SJ2.2 5.95,18.45 6.5,19 R18.1
N$3
  Top 0.254: R17.1 9.5,15.05 SJ1.2
N$4
  Top 0.25: OLED1.26 31.93,20 29.49,20 C4.1
N$5
  Top 0.25: C17.1 29.48,42.5 OLED2.26
N$6
  Top 0.25: C22.1 29.48,65 OLED3.26
N$7
  Top 0.25: C37.1 52.98,65 OLED6.26
N$8
  Top 0.25: 54.25,42.5 52.98,42.5 C32.1
  Top 0.254: OLED5.26 54.25,42.5
N$9
  Top 0.25: 9.35,60.85 10,61.5 R19.1
  Top 0.254: J2.A5 8.59,58.88 9.35,59.65 9.35,60.85
N$10
  Top 0.25: C27.1 52.98,20 OLED4.26
N$11
  Top 0.254: J2.B5 8.91,55.88 10.4,54.4 10.95,54.4 R3.1
N$12
  Top 0.25: C47.1 76.48,42.5 OLED8.26
N$13
  Top 0.25: C42.1 76.48,20 OLED7.26
N$14
  Top 0.25: 80.7,65 76.48,65 C52.1
  Top 0.254: OLED9.26 80.7,65
N$15
  Top 0.25: C57.1 104.52,20 OLED10.26
N$16
  Top 0.25: OLED11.26 103.81,42.5 C62.1
N$17
  Top 0.25: OLED12.26 103.5,65 103.5,65.01 C67.1
OSC_IN
  Top 0.254: C6.2 5.43,25.82 OSC.1 7.3,25.8 7.9,25.8 9,26.9 9,29 9.45,29.45 10.5,29.45 11.06,30.01 UC1.5
OSC_OUT
  Top 0.254: C7.2 12.82,25.98 11.8,27 11.5,27 11,27.5 11,28.11 OSC.3 11.56,28.7 UC1.6
RESET
  Top 0.254: UC1.7 12.06,31.76 12.45,32.15 14.9,32.15 18,29.05 18,25.15 16.65,23.8 R8.1 16.65,15.95 SW13.A' SW13.A
SCK  (via drill 0.3)
  Top 0.25: OLED12.16 v109,58.5 v112,58.5 | v112,13.5 OLED10.16 | OLED11.16 v109,36 v112,36 | 24.5,36 24.71,36.21 v29.95,36.21
  Top 0.254: v88.5,58.5 85.5,58.5 OLED9.16 | v88.5,36 85.5,36 OLED8.16 | v63,36 OLED5.16 | OLED7.16 v88.5,13.5 | OLED4.16 v63,13.5 | OLED6.16 v63,58.5 | OLED2.16 v39.5,36 | OLED3.16 v40,58.5 | 24.5,36 22.16,33.66 UC1.15
  Top 0.305: OLED1.16 38.5,13.5 v39.5,14.5
  Bottom 0.25: v109,58.5 v88.5,58.5 85.5,58.5 | v112,58.5 v112,36 v112,13.5 v88.5,13.5 | v88.5,36 v109,36 | v29.95,36.21 30.16,36 v39.5,36
  Bottom 0.254: v63,13.5 v88.5,13.5 | v39.5,36 v63,36 v88.5,36 | v40,58.5 v63,58.5 85.5,58.5
  Bottom 0.305: v63,13.5 51.6,13.5 50.6,14.5 v39.5,14.5
SW01
  Top 0.254: SW1.A 23.4,15.6 22,17 22,31 20.34,32.66 UC1.13
  Top 0.305: SW1.A SW1.A'
SW02
  Top 0.254: SW2.A 23.1,38.1 20.16,35.16 UC1.18
SW03
  Top 0.254: SW3.A' 25.89,54.39 22,50.5 22,47.5 14.56,40.06 UC1.25
  Top 0.305: SW3.A' SW3.A
SW04  (via drill 0.3)
  Top 0.254: v4,38.5 4.84,37.66 UC1.38
  Top 0.305: SW4.A v50.49,12.75 | v50.49,12.75 50.49,12.5 SW4.A' | v50.5,12.75 v50.49,12.75
  Bottom 0.254: v50.5,12.75 50.25,13 13.5,13 9,17.5 9,31.65 6.4,34.25 6.4,35.85 6,36.25 5.25,36.25 4,37.5 v4,38.5
SW05  (via drill 0.3)
  Top 0.254: 50.5,35.3 v45.05,35.3 | UC1.22 19.11,37.16 20.45,38.5 v22,38.5
  Top 0.305: SW5.A 50.5,35.3 50.5,35 SW5.A'
  Bottom 0.254: v45.05,35.3 26.7,35.3 23.5,38.5 v22,38.5
SW06  (via drill 0.3)
  Top 0.25: TP1.P$1 22.5,58.5
  Top 0.254: 50.5,57.5 v39,57.5 | UC1.30 12.06,43.31 17.75,49 17.75,54.25 22,58.5 22.5,58.5 23,58.5 23.5,58.5 v25.05,58.5
  Top 0.305: SW6.A' 50.5,57.5 SW6.A
  Bottom 0.254: v39,57.5 26.05,57.5 v25.05,58.5
SW07  (via drill 0.3)
  Top 0.254: v4,39.5 4.5,39 5.34,38.16 UC1.37 | SW7.A v74.01,12.71 v74,12.7 v74.01,12.69 SW7.A'
  Bottom 0.25: 4.6,38.8 4.6,38.9 v4,39.5
  Bottom 0.254: v74,12.7 73.85,12.85 51.25,12.85 50.6,13.5 13.7,13.5 9.5,17.7 9.5,31.75 6.9,34.35 6.9,36 6.2,36.7 5.55,36.7 4.6,37.65 4.6,38.5 4.6,38.8
SW08  (via drill 0.3)
  Top 0.254: UC1.21 19.36,36.66 20.2,37.5 v21,37.5
  Top 0.305: SW8.A v74,35.3 SW8.A'
  Bottom 0.254: v74,35.3 46.8,35.3 46.2,34.7 26.65,34.7 23.85,37.5 v21,37.5
SW09  (via drill 0.3)
  Top 0.254: UC1.29 12.56,43.01 18.35,48.8 18.35,53.8 v19.8,55.25
  Top 0.305: SW9.A v74,57.75 SW9.A'
  Bottom 0.254: v74,57.75 40.75,57.75 39.65,56.65 21.2,56.65 v19.8,55.25
SW10  (via drill 0.3)
  Top 0.25: UC1.42 5.87,35.66 v5.82,35.6 | SW10.A v97.5,12.5 SW10.A'
  Bottom 0.25: v5.82,35.6 5.82,34.25 8.6,31.47 8.6,17.33 13.82,12.1 39.08,12.1 39.18,12 61.62,12 61.72,12.1 62.18,12.1 62.28,12 89.12,12 89.22,12.1 97.1,12.1 v97.5,12.5
SW11  (via drill 0.3)
  Top 0.25: UC1.3 10.16,31.25 10.16,31.84 11.76,33.44 v12.56,33.44 | v17,32.05 v20,32.05 | v23,32.5 25,34.5 v25.5,34.5 | SW11.A v97.5,35 SW11.A'
  Bottom 0.25: v12.56,33.44 13.56,33.44 14.95,32.05 v17,32.05 | v20,32.05 22.55,32.05 v23,32.5 | v25.5,34.5 26.28,34.5 26.48,34.3 46.37,34.3 46.97,34.9 72.6,34.9 73,34.5 89.12,34.5 89.22,34.6 97.1,34.6 v97.5,35
SW12  (via drill 0.3)
  Top 0.25: UC1.45 8.65,34.16 v9,34.5 | v14.95,44.55 14.97,44.55 18.9,48.48 18.9,53.35 v20.25,54.71 | SW12.A' v97.5,57.5 SW12.A
  Bottom 0.25: v9,34.5 9,40.5 13.05,44.55 v14.95,44.55 | v20.25,54.71 21.55,56 29.37,56 29.52,56.15 43.65,56.15 44.6,57.1 62.18,57.1 62.28,57 87.12,57 87.22,57.1 97.1,57.1 v97.5,57.5
UART1_RX
  Top 0.25: 18.5,56 TP2.P$1
  Top 0.254: UC1.31 11.56,43.56 17.2,49.2 17.2,54.7 18.5,56
USBDM
  Top 0.25: R14.2 C12.1
  Top 0.254: R14.2 13.7,58.5 15,57.2 15,49 11.06,45.06 UC1.32
USBDP
  Top 0.25: C13.1 R13.2 13.5,57 14.5,56 14.5,50.86 arc-90 14.18,50.55 arc90 13.87,50.23 13.87,50.13 arc90 14.18,49.82 arc-90 14.5,49.5 14.5,49.07 10.56,45.13 | 10.56,45.13 10.56,45 | R20.1 10.18,45.52 10.56,45.13
  Top 0.254: UC1.33 10.56,43.4 10.56,43.5 10.56,45
V_USB
  Top 0.4: U3.3 6.05,51.05 6.5,51.5 7.5,51.5 7.95,51.05 U3.1
  Top 0.5: 7.95,51.05 8.47,51.05 C8.1 11.92,49.52 13.4,51 F1.2
VCOMH
  Top 0.25: C5.1 34.27,19.35 OLED1.25
VCOMH1
  Top 0.25: C16.1 34.37,41.85 OLED2.25
VCOMH2
  Top 0.25: OLED3.25 34.37,64.35 C21.1
VCOMH3
  Top 0.25: C26.1 57.87,19.35 OLED4.25
VCOMH4
  Top 0.254: OLED5.25 57.87,41.85 C31.1
VCOMH5
  Top 0.25: C36.1 57.87,64.35 OLED6.25
VCOMH6
  Top 0.25: C41.1 81.37,19.35 OLED7.25
VCOMH7
  Top 0.25: C46.1 81.37,41.85 OLED8.25
VCOMH8
  Top 0.25: C51.1 81.37,64.35 OLED9.25
VCOMH9
  Top 0.25: C56.1 104.87,19.35 OLED10.25
VCOMH10
  Top 0.25: C61.1 104.37,41.85 OLED11.25
VCOMH11
  Top 0.25: C66.1 103.87,64.35 OLED12.25
VUSB-RAW  (via drill 0.3)
  Top 0.4: J2.VBUS1 8.69,60.09 v8.7,60.1 | J2.VBUS2 8.66,55.19 v8.7,55.15 9.6,54.24 9.6,53.9
  Top 0.406: 9.6,53.9 9.6,53.28 F1.1
  Bottom 0.4: v8.7,55.15 v8.7,60.1

### Text on the board
tNames: GND | PA10/RX | PA09/TX | BOOT0 | BOOT1 | RESET
bNames: Keybon12 REV 1.0 / Romain Bazile 03/2021 / based on a design by / Maximilian Kern / github.com/CoretechR
Measures: 3 | 6 | 9 | 2 | 5 | 8 | 1 | 4 | 7